# Altium project Power.PrjPcb
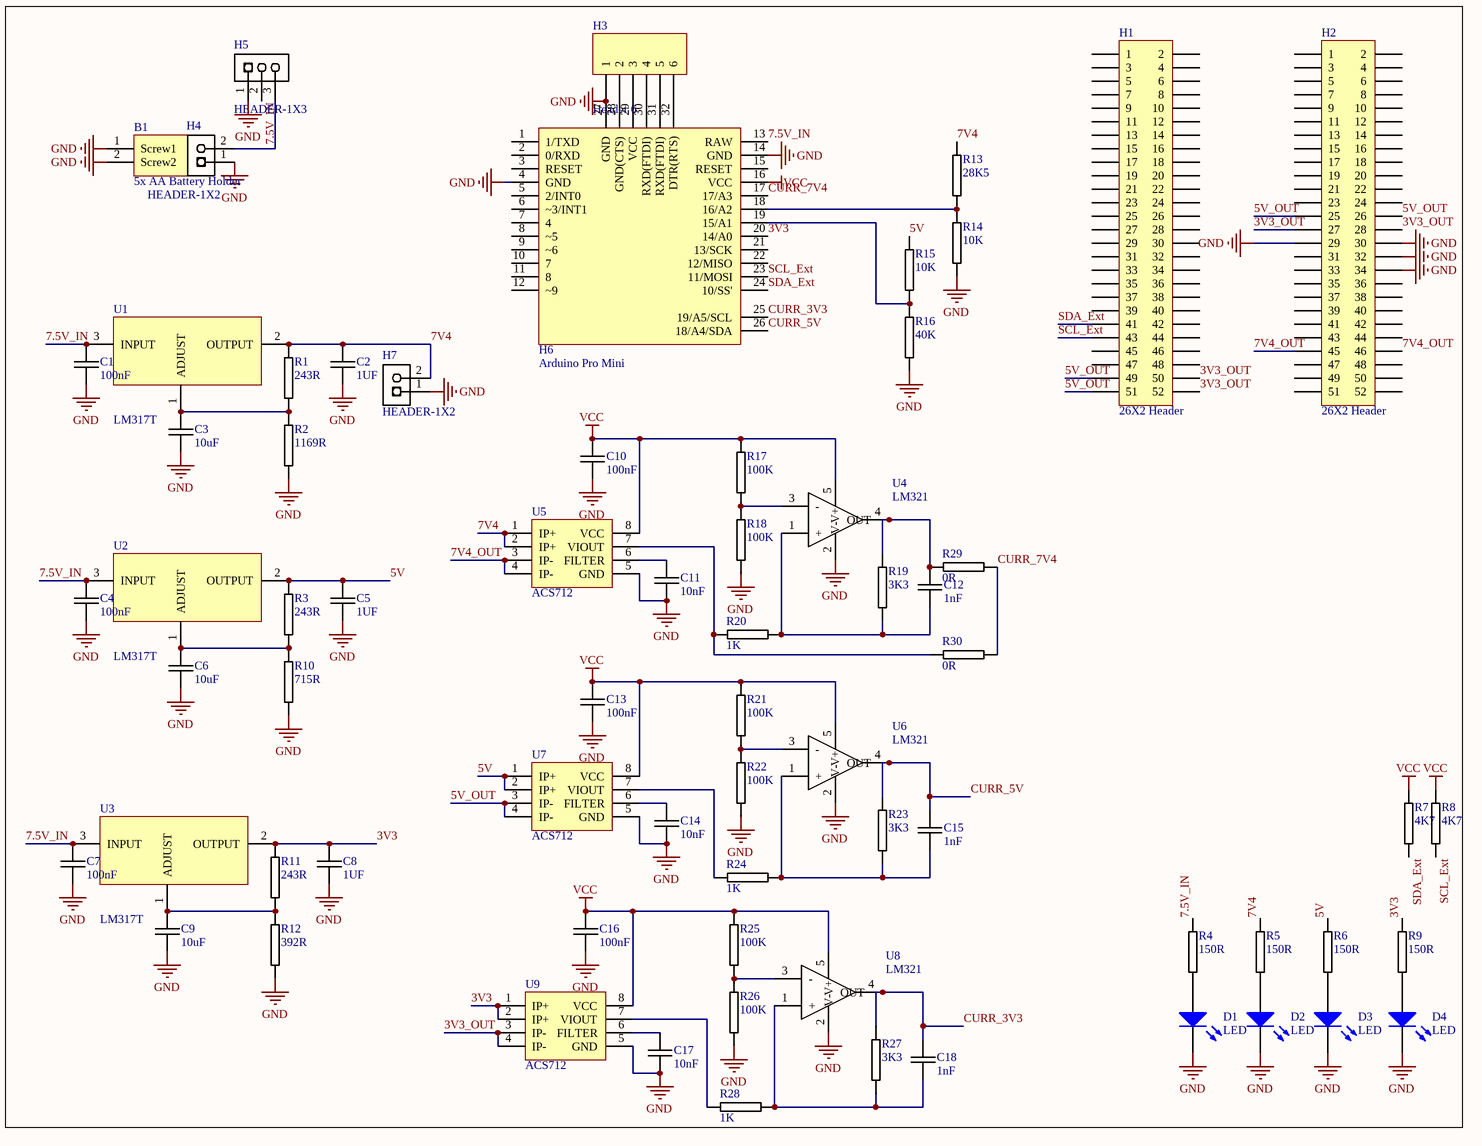
[diagram p0: Power.SchDoc]
1 sheet, 69 parts. Net scope: global (net labels, ports and power ports of the same name join across sheets).
Board file: Power.PcbDoc

## Sheet Power.SchDoc
size 274 x 210 mm

### Parts
B1  5x AA Battery Holder  [5x AA Battery Holder]
C1  100nF  [0805C-TBD]
C2  1UF  [0805C-GENERIC]
C3  10uF  [0805C-GENERIC]
C4  100nF  [0805C-TBD]
C5  1UF  [0805C-GENERIC]
C6  10uF  [0805C-GENERIC]
C7  100nF  [0805C-TBD]
C8  1UF  [0805C-GENERIC]
C9  10uF  [0805C-GENERIC]
C10  100nF  [0805C-TBD]
C11  10nF  [0805C-TBD]
C12  1nF  [0805C-TBD]
C13  100nF  [0805C-TBD]
C14  10nF  [0805C-TBD]
C15  1nF  [0805C-TBD]
C16  100nF  [0805C-TBD]
C17  10nF  [0805C-TBD]
C18  1nF  [0805C-TBD]
D1  LED  [LED]
D2  LED  [LED]
D3  LED  [LED]
D4  LED  [LED]
H1  26X2 Header  [26X2 Header]
H2  26X2 Header  [26X2 Header]
H3  Header 6  [HDR1X6]
H4  HEADER-1X2  [HEADER-1X2]
H5  HEADER-1X3  [HEADER-1X3]
H6  Arduino Pro Mini  [Arduino Pro Mini]
H7  HEADER-1X2  [HEADER-1X2]
R1  243R  [0805R-GENERIC]
R2  1169R  [0805R-GENERIC]
R3  243R  [0805R-GENERIC]
R4  150R  [0805R-150]
R5  150R  [0805R-150]
R6  150R  [0805R-150]
R7  4K7  [0805R-4K7]
R8  4K7  [0805R-4K7]
R9  150R  [0805R-150]
R10  715R  [0805R-GENERIC]
R11  243R  [0805R-GENERIC]
R12  392R  [0805R-GENERIC]
R13  28K5  [0805R-10K]
R14  10K  [0805R-10K]
R15  10K  [0805R-10K]
R16  40K  [0805R-10K]
R17  100K  [0805R-100K]
R18  100K  [0805R-100K]
R19  3K3  [0805R-3K3]
R20  1K  [0805R-1K]
R21  100K  [0805R-100K]
R22  100K  [0805R-100K]
R23  3K3  [0805R-3K3]
R24  1K  [0805R-1K]
R25  100K  [0805R-100K]
R26  100K  [0805R-100K]
R27  3K3  [0805R-3K3]
R28  1K  [0805R-1K]
R29  0R  [0805R-GENERIC]
R30  0R  [0805R-GENERIC]
U1  LM317T  [LM317T]
U2  LM317T  [LM317T]
U3  LM317T  [LM317T]
U4  LM321  [LM321]
U5  ACS712  [ACS712]
U6  LM321  [LM321]
U7  ACS712  [ACS712]
U8  LM321  [LM321]
U9  ACS712  [ACS712]

### Nets
GND: B1.1(Screw1) B1.2(Screw2) C1.2 C2.2 C3.2 C4.2 C5.2 C6.2 C7.2 C8.2 C9.2 C10.2 C11.2 C13.2 C14.2 C16.2 C17.2 D1.2(K) D2.2(K) D3.2(K) D4.2(K) H2.29 H2.30 H2.32 H2.34 H3.1 H4.1 H5.1 H6.4(GND) H6.14(GND) H6.27(GND) H7.1 R2.2 R10.2 R12.2 R14.2 R16.2 R18.2 R22.2 R26.2 U4.2(V-) U5.5(GND) U6.2(V-) U7.5(GND) U8.2(V-) U9.5(GND)
VCC: C10.1 C13.1 C16.1 H6.16(VCC) R7.1 R8.1 R17.1 R21.1 R25.1 U4.5(V+) U5.8(VCC) U6.5(V+) U7.8(VCC) U8.5(V+) U9.8(VCC)
3V3: C8.1 H6.20(14/A0) R9.1 R11.2 U3.2(OUTPUT) U9.1(IP+) U9.2(IP+)
3V3_OUT: H1.50 H1.52 H2.27 H2.28 U9.3(IP-) U9.4(IP-)
5V: C5.1 R3.2 R6.1 R15.1 U2.2(OUTPUT) U7.1(IP+) U7.2(IP+)
5V_OUT: H1.49 H1.51 H2.25 H2.26 U7.3(IP-) U7.4(IP-)
7.5V_IN: C1.1 C4.1 C7.1 H5.2 H6.13(RAW) R4.1 U1.3(INPUT) U2.3(INPUT) U3.3(INPUT)
7V4: C2.1 H7.2 R1.2 R5.1 R13.1 U1.2(OUTPUT) U5.1(IP+) U5.2(IP+)
7V4_OUT: H2.45 H2.46 U5.3(IP-) U5.4(IP-)
CURR_3V3: C18.1 H6.25(19/A5/SCL) R27.1 U8.4(OUT)
CURR_5V: C15.1 H6.26(18/A4/SDA) R23.1 U6.4(OUT)
CURR_7V4: H6.17(17/A3) R29.2 R30.2
SCL_Ext: H1.43 H6.23(11/MOSI) R8.2
SDA_Ext: H1.41 H6.24(10/SS') R7.2
NetC3_1: C3.1 R1.1 R2.1 U1.1(ADJUST)
NetC6_1: C6.1 R3.1 R10.1 U2.1(ADJUST)
NetC9_1: C9.1 R11.1 R12.1 U3.1(ADJUST)
NetC11_1: C11.1 U5.6(FILTER)
NetC12_1: C12.1 R19.1 R29.1 U4.4(OUT)
NetC12_2: C12.2 R19.2 R20.2 U4.1(+)
NetC14_1: C14.1 U7.6(FILTER)
NetC15_2: C15.2 R23.2 R24.2 U6.1(+)
NetC17_1: C17.1 U9.6(FILTER)
NetC18_2: C18.2 R27.2 R28.2 U8.1(+)
NetD1_1: D1.1(A) R4.2
NetD2_1: D2.1(A) R5.2
NetD3_1: D3.1(A) R6.2
NetD4_1: D4.1(A) R9.2
NetH3_2: H3.2 H6.28(GND(CTS))
NetH3_3: H3.3 H6.29(VCC)
NetH3_4: H3.4 H6.30(RXD(FTDI))
NetH3_5: H3.5 H6.31(RXD(FTDI))
NetH3_6: H3.6 H6.32(DTR(RTS))
NetH4_2: H4.2 H5.3
NetH6_18: H6.18(16/A2) R13.2 R14.1
NetH6_19: H6.19(15/A1) R15.2 R16.1
NetR17_2: R17.2 R18.1 U4.3(-)
NetR20_1: R20.1 R30.1 U5.7(VIOUT)
NetR21_2: R21.2 R22.1 U6.3(-)
NetR24_1: R24.1 U7.7(VIOUT)
NetR25_2: R25.2 R26.1 U8.3(-)
NetR28_1: R28.1 U9.7(VIOUT)

Not connected (* = marked no-connect by the designer): H1 1 2 3 4 5 6 7 8 9 10 11 12 13 14 15 16 17 18 19 20 21 22 23 24 25 26 27 28 29 30 31 32 33 34 35 36 37 38 39 40 42 44 45 46 47 48; H2 1 2 3 4 5 6 7 8 9 10 11 12 13 14 15 16 17 18 19 20 21 22 23 24 31 33 35 36 37 38 39 40 41 42 43 44 47 48 49 50 51 52; H6 1(1/TXD) 2(0/RXD) 3(RESET) 5(2/INT0) 6(~3/INT1) 7(4) 8(~5) 9(~6) 10(7) 11(8) 12(~9) 15(RESET) 21(13/SCK) 22(12/MISO)

### Library data of the parts
C1 C4 C7 C10-C18 = 0805C-100nF-25V-X7R-MUR: CAPACITOR 0805 CERAMIC; Supplier 1: Digi-Key; Supplier Part Number 1: 490-1673-1-ND
C2 C5 C8 = 0805C-2U2-6V3-X5R-PAN: CAPACITOR 0805 CERAMIC; Manufacturer Part Number: ECJ-1VB0J225K; Manufacturer: Panasonic - ECG; Reel: C7; Supplier 1: Digi-Key; Supplier Part Number 1: PCC2273TR-ND
C3 C6 C9 = 0805C-10UF-25V-X5R-SAM: CAPACITOR 0805 CERAMIC; Manufacturer 1: Samsung; Manufacturer Part Number 1: CL21A106KACLRNC; Reel: C19; Supplier Part Number 1: CL21A106KACLRNC; Supplierr 1: Samsung
D1-D4 = LED: Small LED
H3 = Header 6: Header, 6-Pin; LatestRevisionDate: 17-Jul-2002; LatestRevisionNote: Re-released for DXP Platform.; Publisher: Altium Limited
H4 H7 = HEADER-1X2: REEL: TH; Supplier 1: Digi-Key; Supplier Part Number 1: S1011E-36-ND
R1-R3 R10-R12 = 0805R-1R: RESISTOR 0805 1/3 WATT; REEL: R84; Supplier 1: Digi-Key; Supplier Part Number 1: 541-1.0TADKR-ND
R4-R6 R9 = 0805R-150: RESISTOR 0805 1/4 WATT THIN FILM; Reel: *
R7 R8 = 0805R-4K7: RESISTOR 0805 1/4 WATT THIN FILM; Reel: *
R13-R16 = 0805R-10K: RESISTOR 0805 1/4 WATT THIN FILM; Reel: *
R17 R18 R21 R22 R25 R26 = 0805R-100K: RESISTOR 0805 1/4 WATT THIN FILM; Reel: *; Supplier 1: Digi-Key; Supplier Part Number 1: RMCF0805FT100KTR-ND
R19 R23 R27 = 0805R-3K3: RESISTOR 0805 1/4 WATT THIN FILM; Reel: *
R20 R24 R28 = 0805R-1K: RESISTOR 0805 1/4 WATT THIN FILM; Reel: *
R29 R30 = 0805R-0R: RESISTOR 0805 1 WATT
U1-U3 = LM317T: Adjustable Voltage Regulator
U4 U6 U8 = LM321: Op-amp
U5 U7 U9 = ACS712: Current Sensor
H5 = HEADER-1X3: Supplier 1: Digi-Key; Supplier Part Number 1: S1011E-36-ND